# Altium schematic sheet Discharge.SchDoc
size Letter; Organization: Midnight Sun Solar Rayce Car Team; Address1: University of Waterloo; Address2: 200 University Ave W; Address3: Waterloo, ON, Canada; Address4: N2L 3E9; Website: www.uwmidsun.com
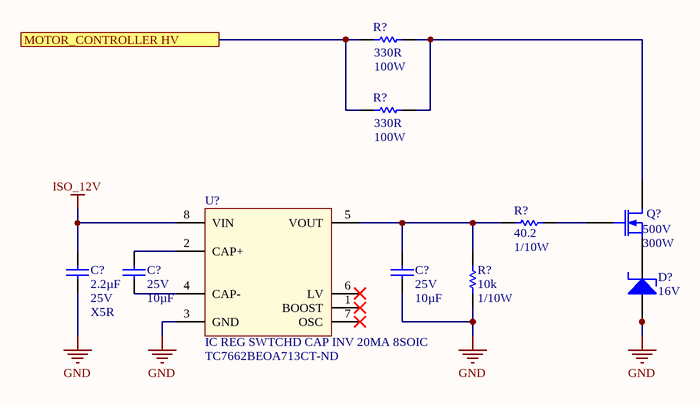
[diagram p0: Discharge.SchDoc]

## Parts
(Parts that share a designator on the sheet are numbered #1, #2 ... from top to bottom, then left to right.)
C?#1  Voltage - Rated: 25V  Capacitance: 10µF  [CAP, 0805]  (hidden comment: CAP CER 10uF 25V 10% X5R 0805)
C?#2  Voltage - Rated: 25V  Capacitance: 10µF  [CAP, 0805]  (hidden comment: CAP CER 10uF 25V 10% X5R 0805)
C?#3  Capacitance: 2.2µF  Voltage: 25V  Temperature Coefficient: X5R  [CAP, 0603]  (hidden comment: CAP CER 2.2UF 25V 10% X5R 0603)
D?  Voltage - Zener (Nom): 16V  [DO-214AA Diode]  (hidden comment: DIODE ZENER 16V 5W DO-214AA (SMB))
Q?  Drain to Source Voltage (Vdss): 500V  Max Power Dissipation: 300W  (hidden comment: MOSFET N-CH 500V 6A TO247)
R?#1  Max Power Dissipation: 100W  Resistance: 330R  (hidden comment: RES 330 OHM 100W 5% TO-247)
R?#2  Max Power Dissipation: 100W  Resistance: 330R  (hidden comment: RES 330 OHM 100W 5% TO-247)
R?#3  Resistance: 40.2  Power: 1/10W  [RES, 0603]  (hidden comment: RES 40.2 OHM 0.5% 1/10W 0603)
R?#4  Resistance: 10k  Power: 1/10W  [RES, 0603]  (hidden comment: RES 10K OHM 1% 1/10W 0603)
U?  IC REG SWTCHD CAP INV 20MA 8SOIC  Supplier Part Number 1: TC7662BEOA713CT-ND

## Ports
MOTOR_CONTROLLER HV

## Nets
GND: C?#2.2 C?#3.1 D?.1(A) Q?.2(S) R?#4.2 U?.3(GND)
ISO_12V: C?#3.2 U?.8(VIN)
MOTOR_CONTROLLER HV: R?#1.1 R?#2.1 ; port MOTOR_CONTROLLER HV
NetC?#1_1: C?#1.1 U?.2(CAP+)
NetC?#1_2: C?#1.2 U?.4(CAP-)
NetC?#2_1: C?#2.1 R?#3.1 R?#4.1 U?.5(VOUT)
NetQ?_1: Q?.1(G) R?#3.2
NetQ?_3: Q?.3(D) R?#1.2 R?#2.2

Not connected (* = marked no-connect by the designer): D? 2(K); U? 1(BOOST)* 6(LV)* 7(OSC)*

## Notes on the sheet
- Project:
- Title:
- Size:
- Project Author
- Letter
- Revision:
- University of Waterloo
- 200 University Ave W
- Waterloo, ON, Canada
- N2L 3E9
- Date:
- Sheet
- of
- Website:

## Library data of the parts
C?#1 C?#2 = CAP CER 10uF 25V 10% X5R 0805: 10µF ±10% 25V Ceramic Capacitor X5R 0805 (2012 Metric); Manufacturer: Murata Electronics North America; Manufacturer Part Number: GRM21BR61E106KA73L; Supplier 1: Digi-Key; RoHS: RoHS Compliant; Category: Capacitors; Stock 1: 1695157; Packaging: Cut Tape (CT); Part Status: Active; Tolerance: ±10%; Temperature Coefficient: X5R; Operating Temperature: -55°C ~ 85°C; Features: -; Ratings: -; Applications: General Purpose; Mounting Type: Surface Mount, MLCC; Package / Case: 0805 (2012 Metric); Size / Dimension: 0.079" L x 0.049" W (2.00mm x 1.25mm); Height - Seated (Max): -; Thickness (Max): 0.053" (1.35mm); Lead Spacing: -; Lead Style: -; ComponentLink1URL: http://search.murata.co.jp/Ceramy/image/img/A01X/G101/ENG/GRM21BR61E106KA73-01.pdf; ComponentLink1Description: http://search.murata.co.jp/Ceramy/image/img/A01X/G101/ENG/GRM21BR61E106KA73-01.pdf; Supplier Part Number 1: 490-5523-1-ND; Pricing 1: 1=0.3, 10=0.214, 100=0.1008, 500=0.07068, 1000=0.05851 (CAD)
C?#3 = CAP CER 2.2UF 25V 10% X5R 0603: 2.2µF ±10% 25V Ceramic Capacitor X5R 0603 (1608 Metric); Manufacturer 1: Murata Electronics North America; Manufacturer Part Number 1: GRM188R61E225KA12D; Supplier 1: Digi-Key; Supplier Part Number 1: 490-10731-1-ND; Packaging: Cut Tape (CT); Part Status: Active; Operating Temperature: -55°C ~ 85°C; Ratings: -; Mounting Type: Surface Mount, MLCC; Package / Case: 0603 (1608 Metric); Size / Dimension: 0.063" L x 0.031" W (1.60mm x 0.80mm); Height - Seated (Max): -; Thickness (Max): 0.035" (0.90mm); Lead Spacing: -; Lead Style: -; ComponentLink1URL: http://www.murata.com/~/media/webrenewal/support/library/catalog/products/capacitor/mlcc/c02e.ashx; ComponentLink1Description: http://www.murata.com/~/media/webrenewal/support/library/catalog/products/capacitor/mlcc/c02e.ashx; Tolerance: ±10%
D? = DIODE ZENER 16V 5W DO-214AA (SMB): Zener Diode 16V 5W ±5% Surface Mount DO-214AA (SMB); Manufacture: Micro Commercial Co; Manufacture Part Number: SMBJ5353B-TP; Impedence (Max): 2.5 Ohm; Voltage - Forward: 1.2V @ 1A; Power (Max): 5W; Supplier 1: Digi-Key; Supplier Part Number 1: SMBJ5353B-TPMSCT-ND
Q? = MOSFET N-CH 500V 6A TO247: N-Channel 500V 6A (Tc) 300W (Tc) Through Hole TO-247 (IXTH); Manufacturer: IXYS; Manufacturer Part Number: IXTH6N50D2; Rds On Max: 500mR; Input Capacitance: 2.8nF; Stock 1: 79; Pricing 1: 1=7.25, 10=6.521, 100=5.3613, 500=4.4919, 1000=3.9123 (USD); Mount: Through Hole; Case/Package: TO-247-3; Packaging: Rail/Tube; Package Quantity: 30; Continuous Drain Current (ID): 6A; ComponentLink1URL: https://datasheet.ciiva.com/949/ds100177bixta-tp-th6n50d2-949628.pdf; ComponentLink1Description: https://datasheet.ciiva.com/949/ds100177bixta-tp-th6n50d2-949628.pdf; ComponentLink2URL: https://datasheet.ciiva.com/26790/ixth6n50d2-26790808.pdf; ComponentLink2Description: https://datasheet.ciiva.com/26790/ixth6n50d2-26790808.pdf; Supplier 1: Digi-Key; Supplier Part Number 1: IXTH6N50D2-ND
R?#1 R?#2 = RES 330 OHM 100W 5% TO-247: Manufacturer: Ohmite; Manufacturer Part Number: AP101330RJ; Voltage Rating: 700V; Temperature Coefficient: 100ppm/°C; Supplier 1: Digi-Key; Stock 1: 0; Case/Package: TO-247-2; Min Operating Temperature: -65°C; Max Operating Temperature: 175°C; Packaging: Tray; Power Rating: 100W; Composition: Thick Film; Number of Terminations: 2; Tolerance: 5%; Voltage Rating (DC): 700V; Length: 0.62inch; Height: 0.825inch; Width: 0.195inch; ComponentLink1URL: http://www.mouser.com/ds/2/303/acl_ap101-773331.pdf; ComponentLink1Description: http://www.mouser.com/ds/2/303/acl_ap101-773331.pdf; ComponentLink2URL: http://www.farnell.com/datasheets/2015590.pdf; ComponentLink2Description: http://www.farnell.com/datasheets/2015590.pdf; ComponentLink3URL: http://www.ohmite.com/cat/acl_ap101.pdf; ComponentLink3Description: http://www.ohmite.com/cat/acl_ap101.pdf; Supplier Part Number 1: AP101 330R J-ND
R?#3 = RES 40.2 OHM 0.5% 1/10W 0603: RES SMD 40.2 OHM 0.5% 1/10W 0603; Manufacturer 1: Yageo; Manufacturer Part Number 1: RT0603DRE0740R2L; Temperature Coefficient: ±50ppm/°C; Supplier 1: Digi-Key; Supplier Part Number 1: 311-2576-1-ND; Packaging: Cut Tape (CT); Part Status: Active; Composition: Thin Film; Operating Temperature: -55°C ~ 155°C; Package / Case: 0603 (1608 Metric); Supplier Device Package: 0603; Size / Dimension: 0.063" L x 0.031" W (1.60mm x 0.80mm); Height - Seated (Max): 0.022" (0.55mm); Failure Rate: -; ComponentLink1URL: http://www.yageo.com/documents/recent/PYu-RT_1-to-0.01_RoHS_L_7.pdf; ComponentLink1Description: http://www.yageo.com/documents/recent/PYu-RT_1-to-0.01_RoHS_L_7.pdf; Tolerance: ±0.5%
R?#4 = RES 10K OHM 1% 1/10W 0603: RES SMD 10K OHM 1% 1/10W 0603; Manufacturer 1: Yageo; Manufacturer Part Number 1: RC0603FR-0710KL; Temperature Coefficient: ±100ppm/°C; Supplier 1: Digi-Key; Supplier Part Number 1: 311-10.0KHRCT-ND; Packaging: Cut Tape (CT); Part Status: Active; Composition: Thick Film; Operating Temperature: -55°C ~ 155°C; Package / Case: 0603 (1608 Metric); Supplier Device Package: 0603; Size / Dimension: 0.063" L x 0.031" W (1.60mm x 0.80mm); Height - Seated (Max): 0.022" (0.55mm); Failure Rate: -; ComponentLink1URL: http://www.yageo.com/documents/recent/PYu-RC_Group_51_RoHS_L_7.pdf; ComponentLink1Description: http://www.yageo.com/documents/recent/PYu-RC_Group_51_RoHS_L_7.pdf; Tolerance: ±1%
U? = IC REG SWTCHD CAP INV 20MA 8SOIC: Charge Pump Switching Regulator IC Positive or Negative Fixed -Vin, 2Vin 1 Output 20mA 8-SOIC (0.154", 3.90mm Width); Manufacturer: Microchip; Manufacturer Part Number: TC7662BEOA713; Number of Outputs: 1; Output Voltage: -15V; Min Supply Voltage: 1.5V; Max Supply Voltage: 15V; Switching Frequency: 35kHz; Synchronous Rectifier: No; Logic Function: Inverting; Output Power: 470mW; Supplier 1: Digi-Key; Stock 1: 59; Pricing 1: 1=2.29, 25=1.9056, 100=1.7304 (USD); Mount: Surface Mount; Case/Package: SOIC; Number of Pins: 8; Weight: 0.006596oz; Min Operating Temperature: -40°C; Max Operating Temperature: 85°C; Package Quantity: 1; Packaging: Tape and Reel; Output Current: 20mA; Max Output Current: 20mA; Max Input Voltage: 15V; Max Output Voltage: -15V; Topology: Charge Pump; Length: 5mm; Height: 1.5mm; Width: 3.99mm; Radiation Hardening: No; Lead Free: Lead Free; ComponentLink1URL: https://datasheet.ciiva.com/2024/21469a-2024368.pdf; ComponentLink1Description: https://datasheet.ciiva.com/2024/21469a-2024368.pdf; ComponentLink2URL: https://datasheet.ciiva.com/2024/filehandler-aspxddocname-en026002-2024369.pdf; ComponentLink2Description: https://datasheet.ciiva.com/2024/filehandler-aspxddocname-en026002-2024369.pdf; ComponentLink3URL: https://datasheet.ciiva.com/16295/filehandler-aspxddocname-en011347-16295442.pdf; ComponentLink3Description: https://datasheet.ciiva.com/16295/filehandler-aspxddocname-en011347-16295442.pdf; ComponentLink4URL: https://datasheet.ciiva.com/3216/cn-21469a-3216331.pdf; ComponentLink4Description: https://datasheet.ciiva.com/3216/cn-21469a-3216331.pdf; ComponentLink5URL: https://datasheet.ciiva.com/18553/filehandler-aspxddocname-en026002-18553038.pdf; ComponentLink5Description: https://datasheet.ciiva.com/18553/filehandler-aspxddocname-en026002-18553038.pdf; ComponentLink6URL: https://datasheet.ciiva.com/4875/21469a-4875151.pdf; ComponentLink6Description: https://datasheet.ciiva.com/4875/21469a-4875151.pdf